# Altium schematic sheet Sensors_PCB.SchDoc
size A
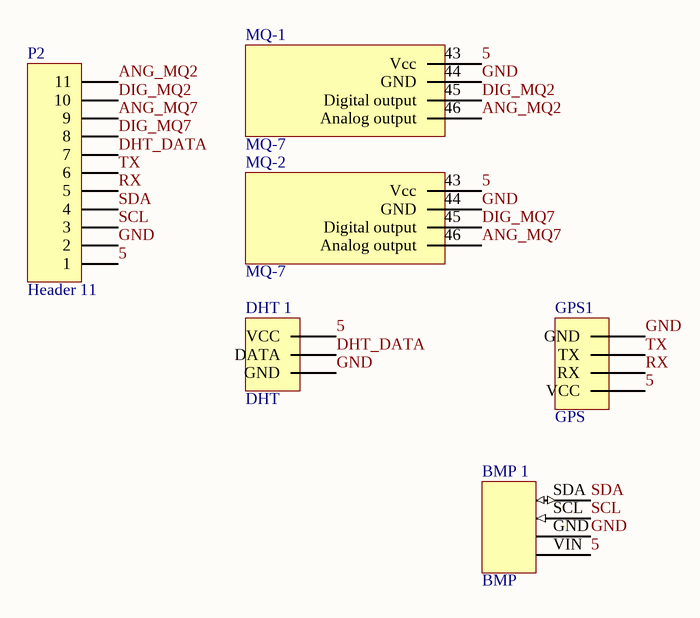
[diagram p0: Sensors_PCB.SchDoc]

## Parts
BMP_1  BMP  [BMP]
DHT_1  DHT  [DHT]
GPS1  GPS  [GPS]
MQ-1  MQ-7  [MQ-7 Up]
MQ-2  MQ-7  [MQ-7 Up]
P2  Header 11  [HDR1X11]

## Nets
5: BMP_1.VIN DHT_1.9(VCC) GPS1.12(VCC) MQ-1.43(Vcc) MQ-2.43(Vcc) P2.1
ANG_MQ2: MQ-1.46(Analog_output) P2.11
ANG_MQ7: MQ-2.46(Analog_output) P2.9
DHT_DATA: DHT_1.10(DATA) P2.7
DIG_MQ2: MQ-1.45(Digital_output) P2.10
DIG_MQ7: MQ-2.45(Digital_output) P2.8
GND: BMP_1.GND DHT_1.11(GND) GPS1.15(GND) MQ-1.44(GND) MQ-2.44(GND) P2.2
RX: GPS1.13(RX) P2.5
SCL: BMP_1.SCL P2.3
SDA: BMP_1.SDA P2.4
TX: GPS1.14(TX) P2.6

## Library data of the parts
P2 = Header 11: Header, 11-Pin; LatestRevisionDate: 17-Jul-2002; LatestRevisionNote: Re-released for DXP Platform.; Publisher: Altium Limited